# Altium schematic sheet Schroom_napajanje2.SchDoc
size A4
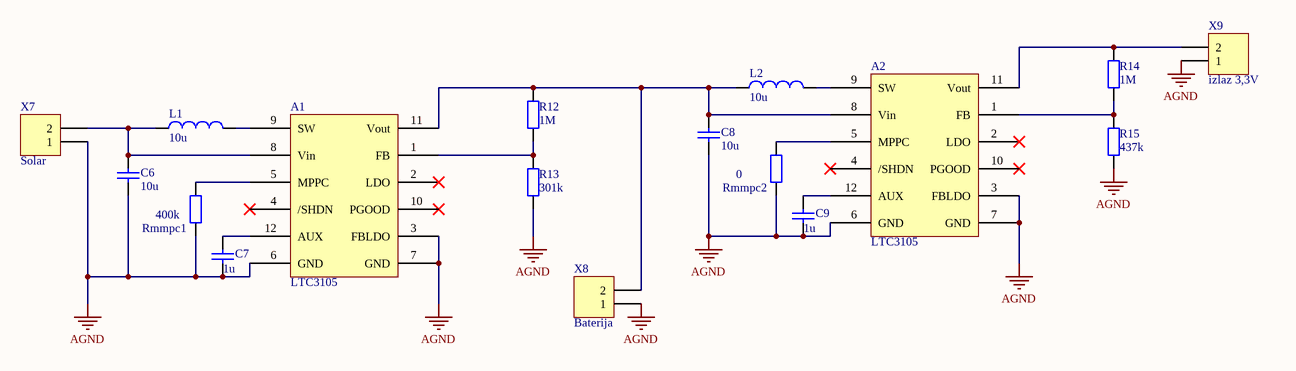
[diagram p0: Schroom_napajanje2.SchDoc]

## Parts
A1  LTC3105  [SOP65P490X110-12N]
A2  LTC3105  [SOP65P490X110-12N]
C6  10u  [6-0805_N]
C7  1u  [6-0805_N]
C8  10u  [6-0805_N]
C9  1u  [6-0805_N]
L1  10u  [6-0805_N]
L2  10u  [6-0805_N]
R12  1M  [6-0805_N]
R13  301k  [6-0805_N]
R14  1M  [6-0805_N]
R15  437k  [6-0805_N]
Rmmpc1  400k  [6-0805_N]
Rmmpc2  0  [6-0805_N]
X7  Solar  [HDR1X2]
X8  Baterija  [HDR1X2]
X9  izlaz 3,3V  [HDR1X2]

## Nets
AGND: A1.3(FBLDO) A1.6(GND) A1.7(GND) A2.3(FBLDO) A2.6(GND) A2.7(GND) C6.1 C7.1 C8.1 C9.1 R13.2 R15.2 Rmmpc1.1 Rmmpc2.1 X7.1 X8.1 X9.1
NetA1_1: A1.1(FB) R12.1 R13.1
NetA1_5: A1.5(MPPC) Rmmpc1.2
NetA1_8: A1.8(Vin) C6.2 L1.1 X7.2
NetA1_9: A1.9(SW) L1.2
NetA1_11: A1.11(Vout) A2.8(Vin) C8.2 L2.1 R12.2 X8.2
NetA1_12: A1.12(AUX) C7.2
NetA2_1: A2.1(FB) R14.1 R15.1
NetA2_5: A2.5(MPPC) Rmmpc2.2
NetA2_9: A2.9(SW) L2.2
NetA2_11: A2.11(Vout) R14.2 X9.2
NetA2_12: A2.12(AUX) C9.2

Not connected (* = marked no-connect by the designer): A1 2(LDO)* 4(/SHDN)* 10(PGOOD)*; A2 2(LDO)* 4(/SHDN)* 10(PGOOD)*

## Library data of the parts
C6-C9 = Cap: Capacitor; Value: 100pF; Published: 8-Jun-2000; LatestRevisionDate: 17-Jul-2002; LatestRevisionNote: Re-released for DXP Platform.; PackageReference: RAD-0.3; Publisher: Altium Limited; PackageDescription: Radial Cap, Thru-Hole; 2 Leads; 0.3 in Pin Spacing
L1 L2 = Inductor: Code_IEC: 1005; Value: 10mH; Published: 8-Jun-2000; LatestRevisionDate: 29-May-2009; LatestRevisionNote: IPC-7351 Footprint Added.; PackageReference: 0402-A; Publisher: Altium Limited; PackageDescription: Chip Inductor; Code_JEITA: 0402
R12-R15 Rmmpc1 Rmmpc2 = Res2: Resistor; Value: 1K; Published: 8-Jun-2000; LatestRevisionDate: 17-Jul-2002; LatestRevisionNote: Re-released for DXP Platform.; PackageReference: AXIAL-0.4; Publisher: Altium Limited; PackageDescription: Axial Device, Thru-Hole; 2 Leads; 0.4 in Pin Spacing
X7-X9 = Header 2: Header, 2-Pin; LatestRevisionDate: 17-Jul-2002; LatestRevisionNote: Re-released for DXP Platform.; Publisher: Altium Limited